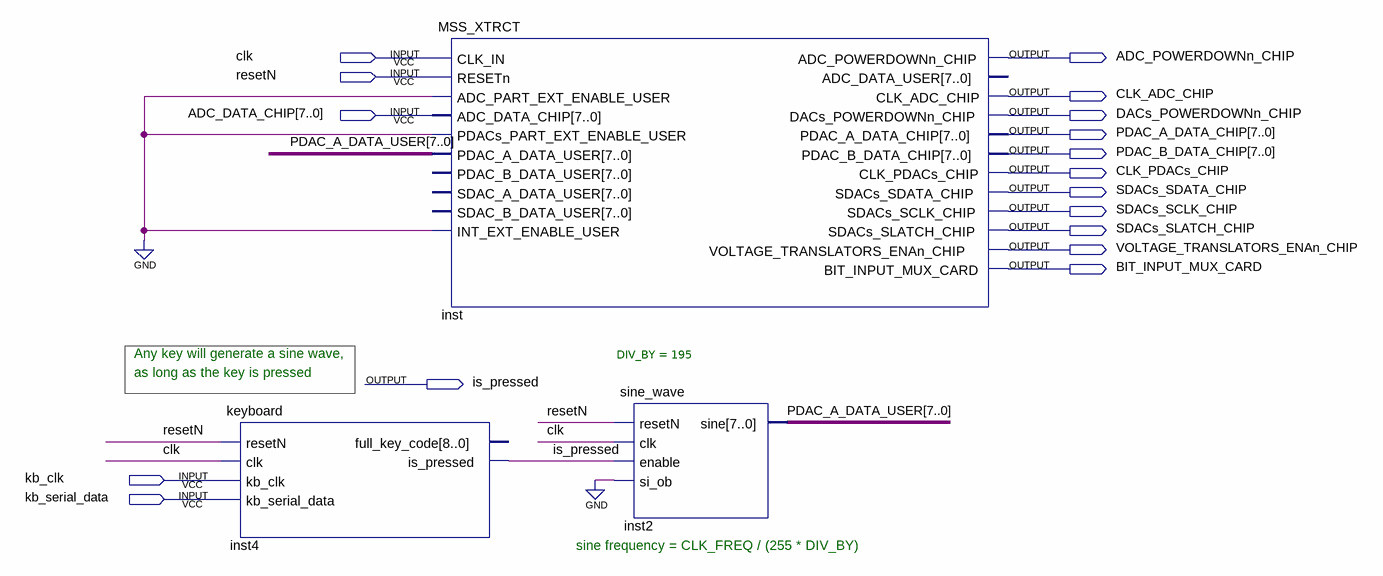
[diagram p0: schematic sheet]
// Quartus schematic sine_wave_generation_with_kb.bdf as structural Verilog: 3 symbols, 17 pins
module sine_wave_generation_with_kb (
  input  clk,
  input  resetN,
  input  [7:0] ADC_DATA_CHIP,
  input  kb_clk,
  input  kb_serial_data,
  output ADC_POWERDOWNn_CHIP,
  output CLK_ADC_CHIP,
  output DACs_POWERDOWNn_CHIP,
  output [7:0] PDAC_A_DATA_CHIP,
  output [7:0] PDAC_B_DATA_CHIP,
  output CLK_PDACs_CHIP,
  output SDACs_SDATA_CHIP,
  output SDACs_SCLK_CHIP,
  output SDACs_SLATCH_CHIP,
  output VOLTAGE_TRANSLATORS_ENAn_CHIP,
  output BIT_INPUT_MUX_CARD,
  output is_pressed
);

  wire [7:0] PDAC_A_DATA_USER;

  keyboard inst4 (
    .resetN(resetN), .clk(clk), .kb_clk(kb_clk), .kb_serial_data(kb_serial_data), .is_pressed(is_pressed));  // open: full_key_code
  MSS_XTRCT inst (
    .CLK_IN(clk), .RESETn(resetN), .ADC_PART_EXT_ENABLE_USER(1'b0), .ADC_DATA_CHIP(ADC_DATA_CHIP),
    .PDACs_PART_EXT_ENABLE_USER(1'b0), .PDAC_A_DATA_USER(PDAC_A_DATA_USER), .INT_EXT_ENABLE_USER(1'b0),
    .ADC_POWERDOWNn_CHIP(ADC_POWERDOWNn_CHIP), .CLK_ADC_CHIP(CLK_ADC_CHIP),
    .DACs_POWERDOWNn_CHIP(DACs_POWERDOWNn_CHIP), .PDAC_A_DATA_CHIP(PDAC_A_DATA_CHIP),
    .PDAC_B_DATA_CHIP(PDAC_B_DATA_CHIP), .CLK_PDACs_CHIP(CLK_PDACs_CHIP),
    .SDACs_SDATA_CHIP(SDACs_SDATA_CHIP), .SDACs_SCLK_CHIP(SDACs_SCLK_CHIP),
    .SDACs_SLATCH_CHIP(SDACs_SLATCH_CHIP), .VOLTAGE_TRANSLATORS_ENAn_CHIP(VOLTAGE_TRANSLATORS_ENAn_CHIP),
    .BIT_INPUT_MUX_CARD(BIT_INPUT_MUX_CARD));  // open: PDAC_B_DATA_USER, SDAC_A_DATA_USER, SDAC_B_DATA_USER, ADC_DATA_USER
  sine_wave #(.DIV_BY(195)) inst2 (
    .resetN(resetN), .clk(clk), .enable(is_pressed), .si_ob(1'b0), .sine(PDAC_A_DATA_USER));

  // Notes on the sheet:
  //   Any key will generate a sine wave,
  //   as long as the key is pressed
  //   sine frequency = CLK_FREQ / (255 * DIV_BY)
endmodule
